# EAGLE design BB ISP v0.1 (EAGLE 6.5.0)
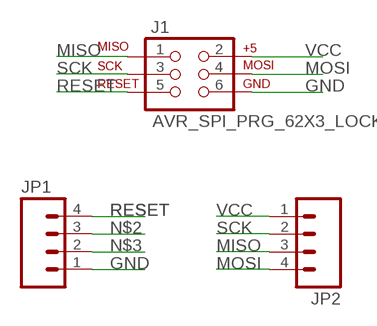
[diagram p0: schematic, sheet 1]

## Parts
J1  AVR_SPI_PRG_62X3_LOCK  [2X3_LOCK]
JP1  M04PTH  [1X04]
JP2  M04PTH  [1X04]

## Nets
GND: J1.6 JP1.1
MISO: J1.1 JP2.3
MOSI: J1.4 JP2.4
N$2: JP1.3
N$3: JP1.2
RESET: J1.5 JP1.4
SCK: J1.3 JP2.2
VCC: J1.2 JP2.1

## Library data of the parts
J1 = SparkFun-Connectors:AVR_SPI_PRG_6: AVR ISP 6 Pin This is the reduced ISP connector for AVR programming. Common on Arduino. This footprint will take up less PCB space and can be used with a 10-pin to 6-pin adapter such as SKU: BOB-08508
JP1 JP2 = SparkFun-Connectors:M04: Header 4 Standard 4-pin 0.1" header. Use with straight break away headers (SKU : PRT-00116), right angle break away headers (PRT-00553), swiss pins (PRT-00743), machine pins (PRT-00117), and female headers (PRT-00115). Molex polarized connector foot print use with SKU : PRT-08231 with associated crimp pins and housings. 1MM SMD Version SKU: PRT-10208

## Net classes
0 default: width 0.254 mm

## Board
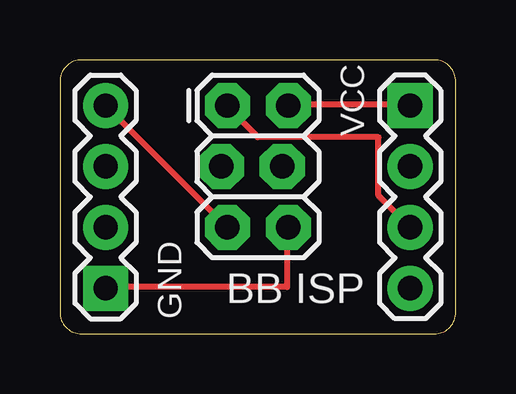
[diagram p1: board, top side]
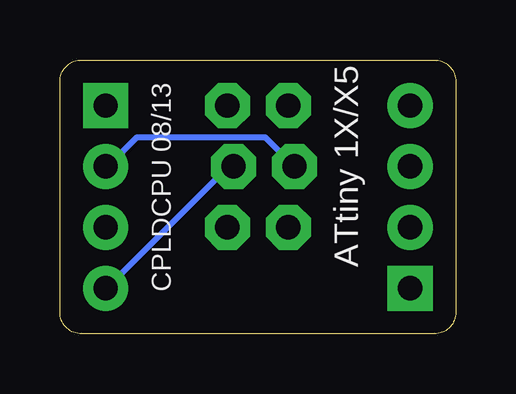
[diagram p2: board, bottom side, seen from below]

Size 16.51 x 11.43 mm. Coordinates in mm from the lower left corner, seen from the top.
Outline: 0,10.53 0,0.9 arc90 0.9,0 15.61,0 arc90 16.51,0.9 16.51,10.53 arc90 15.61,11.43 0.9,11.43 arc90 0,10.53
Copper layers (1*16): Top 0.0356mm / dielectric 1.5011mm / Bottom 0.0356mm
Design rules "LaenPCBOrder": minimum track width 6mil, minimum drill 13mil, track to track 6mil, track to pad 6mil, pad to pad 6mil, via to via 6mil, smd to smd 6mil, copper to edge 15mil, drill to drill 6mil, minimum pad ring 7mil, minimum via ring 7mil, stop-mask expansion 4mil, vias tented up to drill 0mil, thermal gap 10mil

### Footprints (pad centres in the part's own frame; a part is rotated, then mirrored left to right if it is on the bottom)
2X3_LOCK = drill 1.016 pad 1.88 octagon: 1 0,0; 2 0,2.54; 3 2.54,-0.254; 4 2.54,2.286; 5 5.08,0; 6 5.08,2.54
1X04 = drill 1.016 pad 1.88 square: 1 0,0 | drill 1.016 pad 1.88: 2 2.54,0; 3 5.08,0; 4 7.62,0

### Placement (x,y rotation side)
J1  6.98,9.53 270 top
JP1  1.91,1.91 90 top
JP2  14.61,9.53 270 top

### Tracks (layer width: path | path; a pad name or v marks a point on that pad's centre or on a via)
GND
  Top 0.254: JP1.1 2.01,1.96 9.47,1.96 9.47,4.39 J1.6
MISO
  Top 0.254: JP2.3 13.28,5.77 13.28,8.2 8.26,8.2 7.04,9.42 J1.1
MOSI
  Bottom 0.254: J1.4 9.47,6.99 14.5,1.96 JP2.4
RESET
  Top 0.254: J1.5 JP1.4
SCK
  Bottom 0.254: J1.3 7.95,8.2 13.28,8.2 14.5,6.99 JP2.2
VCC
  Top 0.254: J1.2 9.63,9.58 14.5,9.58 JP2.1

### Text on the board
tPlace: VCC | BB ISP | GND
bPlace: ATtiny 1X/X5 | CPLDCPU 08/13